# EasyEDA schematic Senior_Receiver.json
TITLE: Sheet_1; REV: 1.0; Date: 2026-03-06; Sheet: 1/1; Company: Your Company
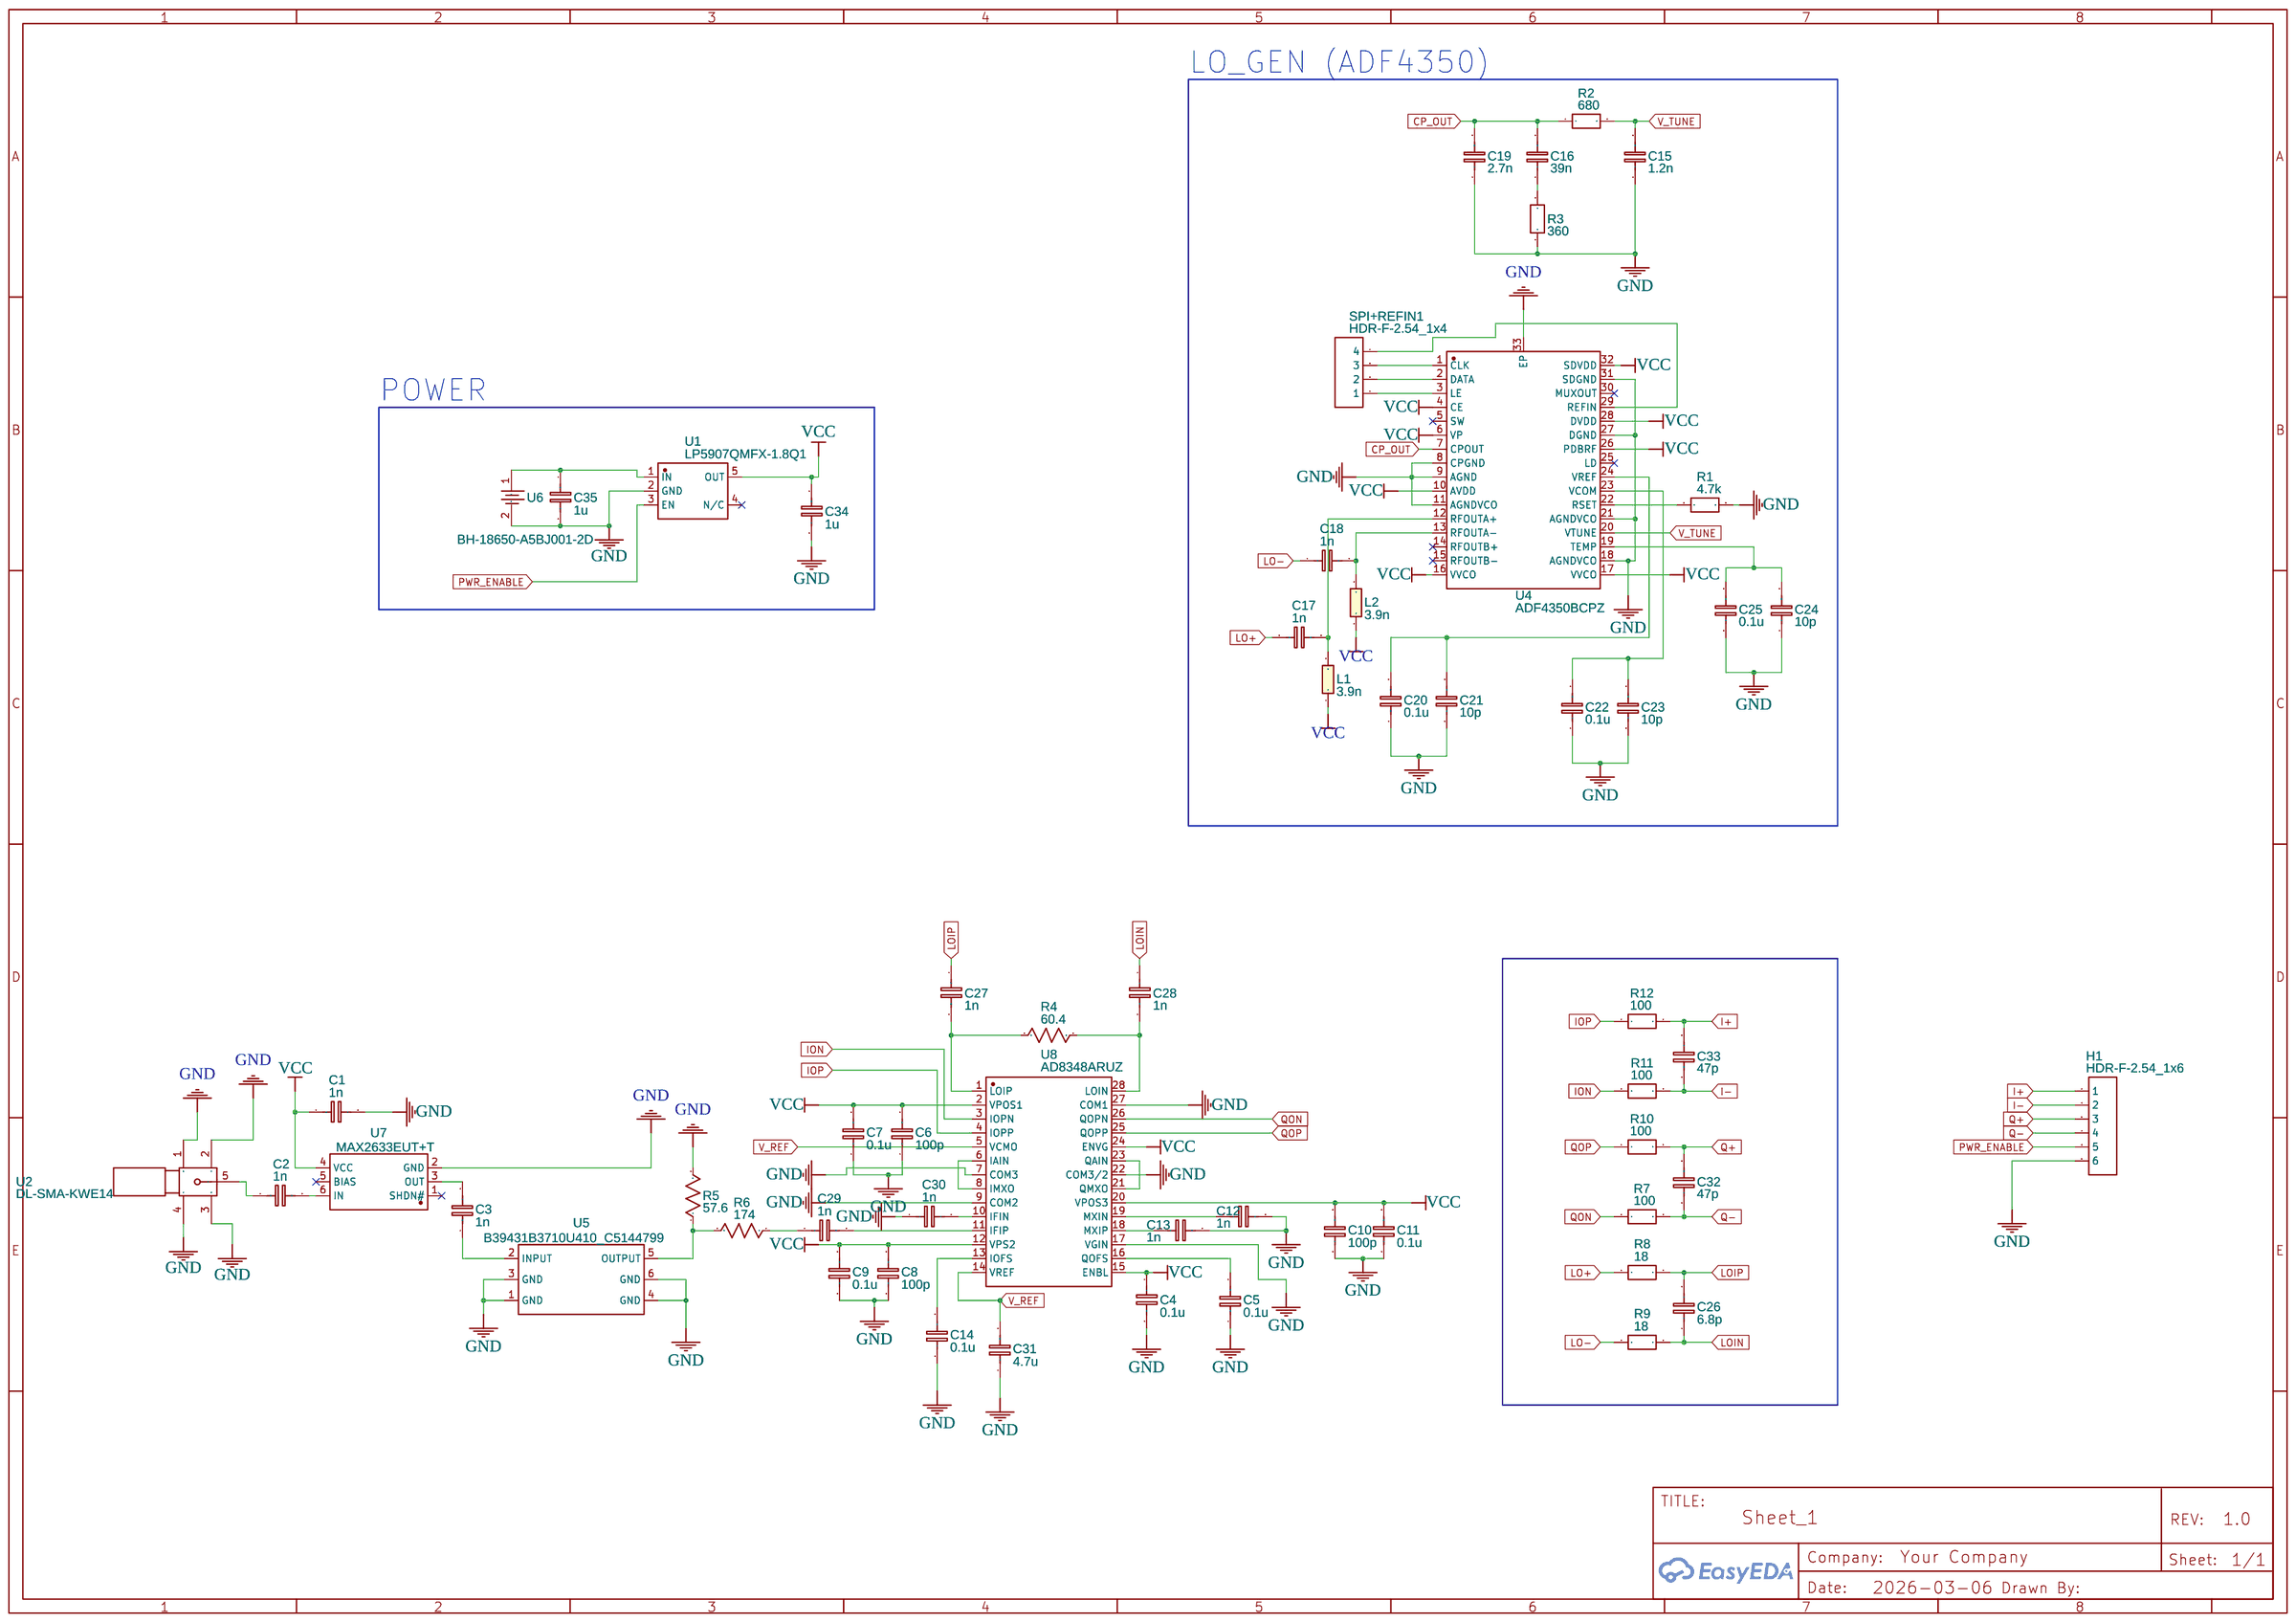
[diagram p0: schematic sheet]

## Parts
C1  1n  [C0603]
C2  1n  [C0603]
C3  1n  [C0603]
C4  0.1u  [C0603]
C5  0.1u  [C0603]
C6  100p  [C0603]
C7  0.1u  [C0603]
C8  100p  [C0603]
C9  0.1u  [C0603]
C10  100p  [C0603]
C11  0.1u  [C0603]
C12  1n  [C0603]
C13  1n  [C0603]
C14  0.1u  [C0603]
C15  1.2n  [C0603]
C16  39n  [C0603]
C17  1n  [C0603]
C18  1n  [C0603]
C19  2.7n  [C0603]
C20  0.1u  [C0603]
C21  10p  [C0603]
C22  0.1u  [C0603]
C23  10p  [C0603]
C24  10p  [C0603]
C25  0.1u  [C0603]
C26  6.8p  [C0402]
C27  1n  [C0603]
C28  1n  [C0603]
C29  1n  [C0603]
C30  1n  [C0603]
C31  4.7u  [C0603]
C32  47p  [C0603]
C33  47p  [C0603]
C34  1u  [C0603]
C35  1u  [C0603]
H1  HDR-F-2.54_1x6  [HDR-F-2.54_1X6]
L1  3.9n  [L0603]
L2  3.9n  [L0603]
R1  4.7k  [R0603]
R2  680  [R0603]
R3  360  [R0603]
R4  60.4  [R0603]
R5  57.6  [R0603]
R6  174  [R0603]
R7  100  [R0603]
R8  18  [R0402]
R9  18  [R0402]
R10  100  [R0603]
R11  100  [R0603]
R12  100  [R0603]
SPI+REFIN1  HDR-F-2.54_1x4  [HDR-F-2.54_1X4]
U1  LP5907QMFX-1.8Q1  [SOT-23-5_L2.9-W1.6-P0.95-LS2.8-BR]
U2  DL-SMA-KWE14  [RF-SMA-TH_DL-SMA-KWE14]
U4  ADF4350BCPZ  [LFCSP-32_L5.0-W5.0-P0.50-TL-EP3.1]
U5  B39431B3710U410_C5144799  [OSC-SMD_6P-L3.0-W3.0-BL-1]
U6  BH-18650-A5BJ001-2D  [BAT-TH_BH-18650-A5BJ001-2D]
U7  MAX2633EUT+T  [SOT-23-6_L2.9-W1.6-P0.95-LS2.8-BL]
U8  AD8348ARUZ  [TSSOP-28_L9.7-W4.4-P0.65-LS6.4-BL]

## Library data of the parts
C1-C25 C27-C35 = C_0603_EU: Contributor: LCEDA_Lib
C26 = C_0402_EU: Contributor: LCEDA_Lib
H1 = HDR-F-2.54_1x6: Supplier Part: C40877; Supplier: LCSC; Contributor: LCEDA_Lib
L1 L2 = L0603_EU: Contributor: LCEDA_Lib
R1-R3 R7 R10-R12 = R_0603_EU: Contributor: LCEDA_Lib
R4-R6 = R_0603_US: Contributor: LCEDA_Lib
R8 R9 = R_0402_EU: Contributor: LCEDA_Lib
SPI+REFIN1 = HDR-F-2.54_1x4: Supplier Part: C225501; Supplier: LCSC; Contributor: LCEDA_Lib
U1 = LP5907QMFX-1.8Q1: Contributor: LCSC; Supplier: LCSC; Supplier Part: C2942279; Manufacturer: TI(德州仪器); JLCPCB Part Class: Extended Part
U2 = DL-SMA-KWE14: Contributor: lcsc; Supplier: LCSC; Supplier Part: C5180388; Manufacturer: DEALON(德艺隆); JLCPCB Part Class: Extended Part
U4 = ADF4350BCPZ: Contributor: LCSC; Supplier: LCSC; Supplier Part: C578982; Manufacturer: ADI(亚德诺); JLCPCB Part Class: Extended Part
U5 = B39431B3710U410_C5144799: Contributor: lcsc; Supplier: LCSC; Supplier Part: C5144799; Manufacturer: null; Manufacturer Part: B39431B3710U410; JLCPCB Part Class: Extended Part
U6 = BH-18650-A5BJ001-2D: Supplier: LCSC; Supplier Part: C19184083; Manufacturer: MYOUNG(美阳); JLCPCB Part Class: Extended Part; Contributor: lcsc
U7 = MAX2633EUT+T: Supplier: LCSC; Supplier Part: C490978; Manufacturer: ADI(亚德诺)/MAXIM(美信); Contributor: lcsc; JLCPCB Part Class: Extended Part
U8 = AD8348ARUZ: Contributor: LCSC; Supplier: LCSC; Supplier Part: C652728; Manufacturer: ADI(亚德诺)

## Nets
GND: C1.2 C4.2 C5.1 C6.1 C7.1 C8.1 C9.1 C10.1 C11.1 C12.2 C13.2 C14.1 C15.1 C19.1 C20.1 C21.1 C22.1 C23.1 C24.1 C25.1 C30.1 C31.1 C34.2 C35.2 H1.6 R1.2 R3.1 R5.2 U1.2(GND) U2.1 U2.2 U2.3 U2.4 U4.8(CPGND) U4.9(AGND) U4.11(AGNDVCO) U4.18(AGNDVCO) U4.21(AGNDVCO) U4.27(DGND) U4.31(SDGND) U4.33(EP) U5.1(GND) U5.3(GND) U5.4(GND) U5.6(GND) U6.2 U7.2(GND) U8.7(COM3) U8.9(COM2) U8.17(VGIN) U8.22(COM3/2) U8.27(COM1)
VCC: C1.1 C4.1 C6.2 C7.2 C8.2 C9.2 C10.2 C11.2 C34.1 L1.1 L2.1 U1.5(OUT) U4.4(CE) U4.6(VP) U4.10(AVDD) U4.16(VVCO) U4.17(VVCO) U4.26(PDBRF) U4.28(DVDD) U4.32(SDVDD) U7.4(VCC) U8.2(VPOS1) U8.12(VPS2) U8.15(ENBL) U8.20(VPOS3) U8.24(ENVG)
CP_OUT: C16.2 C19.2 R2.1 U4.7(CPOUT)
I+: C33.2 H1.1 R12.2
I-: C33.1 H1.2 R11.2
ION: R11.1 U8.3(IOPN)
IOP: R12.1 U8.4(IOPP)
LO+: C17.1 R8.1
LO-: C18.1 R9.1
LOIN: C26.1 C28.1 R9.2
LOIP: C26.2 C27.1 R8.2
PWR_ENABLE: H1.5 U1.3(EN)
Q+: C32.2 H1.3 R10.2
Q-: C32.1 H1.4 R7.2
QON: R7.1 U8.26(QOPN)
QOP: R10.1 U8.25(QOPP)
V_REF: C31.2 U8.5(VCMO) U8.14(VREF)
V_TUNE: C15.2 R2.2 U4.20(VTUNE)
Net-(C2-1): C2.1 U2.5
Net-(C2-2): C2.2 U7.6(IN)
Net-(C3-1): C3.1 U5.2(INPUT)
Net-(C3-2): C3.2 U7.3(OUT)
Net-(C5-2): C5.2 U8.16(QOFS)
Net-(C12-1): C12.1 U8.19(MXIN)
Net-(C13-1): C13.1 U8.18(MXIP)
Net-(C14-2): C14.2 U8.13(IOFS)
Net-(C16-1): C16.1 R3.2
Net-(C17-2): C17.2 L1.2 U4.12(RFOUTA+)
Net-(C18-2): C18.2 L2.2 U4.13(RFOUTA-)
Net-(C20-2): C20.2 C21.2 U4.24(VREF)
Net-(C22-2): C22.2 C23.2 U4.23(VCOM)
Net-(C24-2): C24.2 C25.2 U4.19(TEMP)
Net-(C27-2): C27.2 R4.1 U8.1(LOIP)
Net-(C28-2): C28.2 R4.2 U8.28(LOIN)
Net-(C29-1): C29.1 R6.1
Net-(C29-2): C29.2 U8.11(IFIP)
Net-(C30-2): C30.2 U8.10(IFIN)
Net-(C35-1): C35.1 U1.1(IN) U6.1
Net-(R1-1): R1.1 U4.22(RSET)
Net-(R5-1): R5.1 R6.2 U5.5(OUTPUT)
Net-(SPI+REFIN1-1): SPI+REFIN1.1 U4.3(LE)
Net-(SPI+REFIN1-2): SPI+REFIN1.2 U4.2(DATA)
Net-(SPI+REFIN1-3): SPI+REFIN1.3 U4.1(CLK)
Net-(SPI+REFIN1-4): SPI+REFIN1.4 U4.29(REFIN)
Net-(U8-6): U8.6(IAIN) U8.8(IMXO)
Net-(U8-21): U8.21(QMXO) U8.23(QAIN)

Not connected (* = marked no-connect by the designer): U1 4(N/C)*; U4 5(SW)* 14(RFOUTB+)* 15(RFOUTB-)* 25(LD)* 30(MUXOUT)*; U7 1(SHDN#)* 5(BIAS)*

## Notes on the sheet
- LO_GEN (ADF4350)
- POWER
